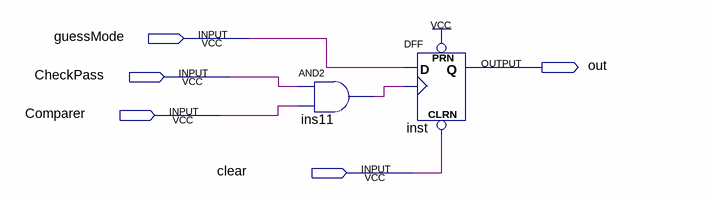
[diagram p0: schematic sheet]
// Quartus schematic isgameFinishedModule.bdf as structural Verilog: 2 symbols, 5 pins
module isgameFinishedModule (
  input  guessMode,
  input  CheckPass,
  input  Comparer,
  input  clear,
  output out
);

  wire ins11_out;

  and ins11 (ins11_out, CheckPass, Comparer);
  DFF inst (.CLRN(clear), .CLK(ins11_out), .D(guessMode), .PRN(1'b1), .Q(out));
endmodule
